# Altium schematic sheet Sheet1.SchDoc
size A4; SheetNumber: 1; SheetTotal: 1
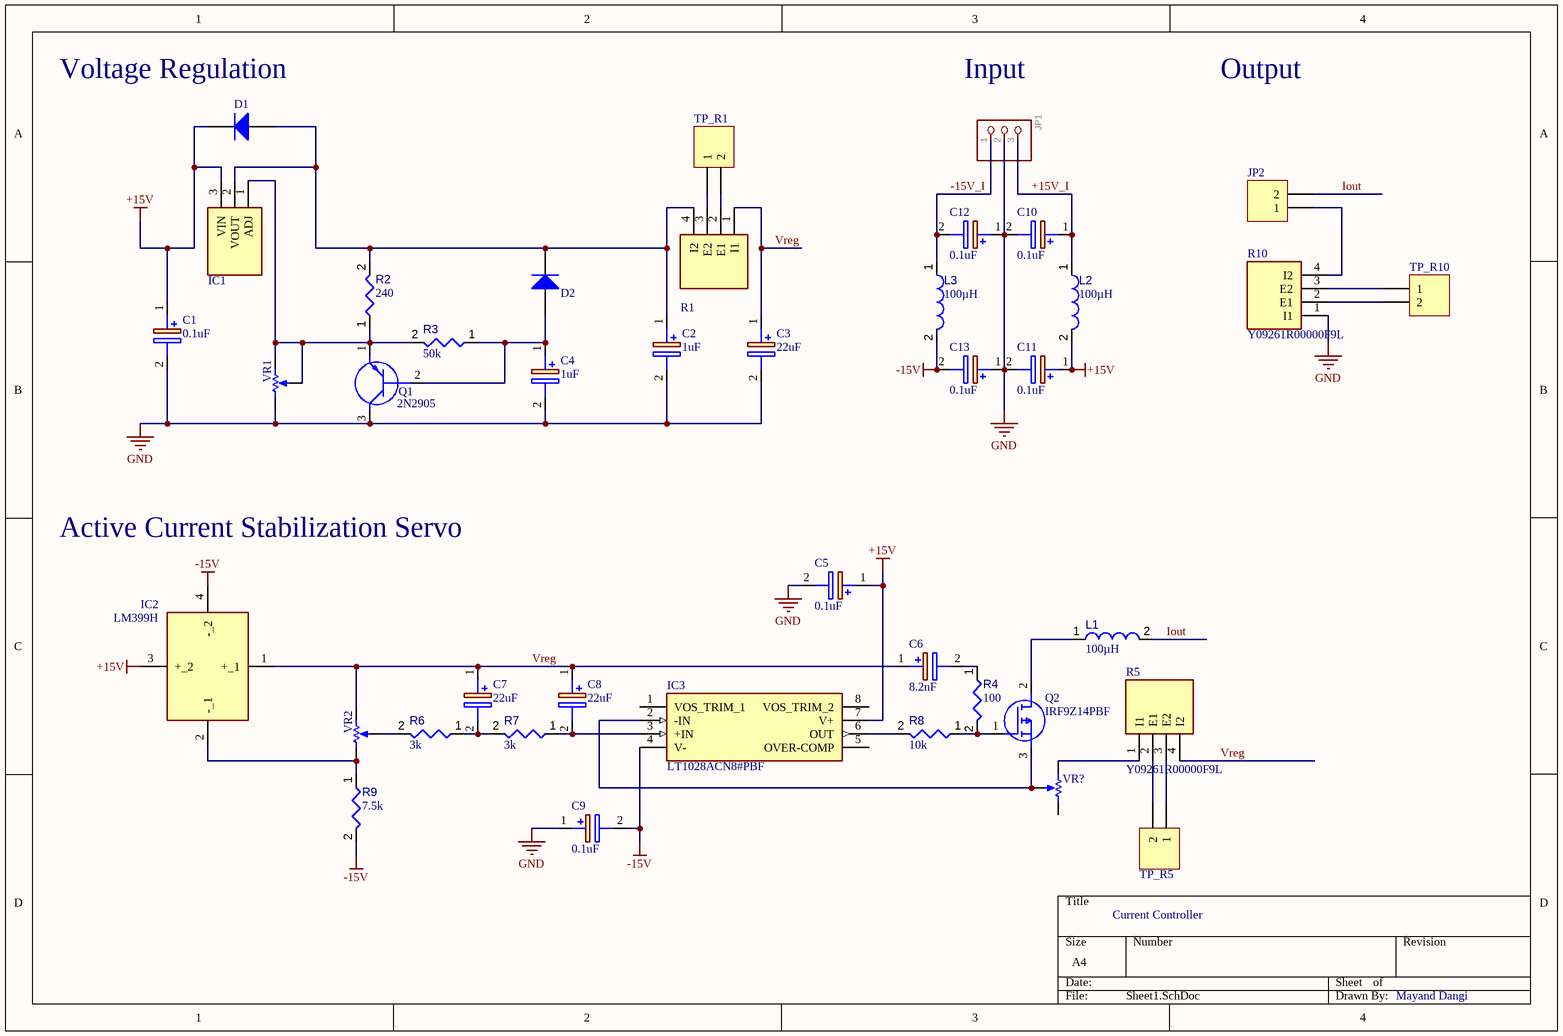
[diagram p0: Sheet1.SchDoc]

## Parts
C1  value 0.1uF  [CAPPRD200W65D525H1250]  (hidden comment: RFS-16V100ME3#5)
C2  value 1uF  [CAPPRD200W65D525H1250]  (hidden comment: RFS-16V100ME3#5)
C3  value 22uF  [CAPPRD200W65D525H1250]  (hidden comment: RFS-16V100ME3#5)
C4  value 1uF  [CAPPRD200W65D525H1250]  (hidden comment: RFS-16V100ME3#5)
C5  value 0.1uF  [CAPPRD200W65D525H1250]  (hidden comment: RFS-16V100ME3#5)
C6  value 8.2nF  [CAPPRD200W65D525H1250]  (hidden comment: RFS-16V100ME3#5)
C7  value 22uF  [CAPPRD200W65D525H1250]  (hidden comment: RFS-16V100ME3#5)
C8  value 22uF  [CAPPRD200W65D525H1250]  (hidden comment: RFS-16V100ME3#5)
C9  value 0.1uF  [CAPPRD200W65D525H1250]  (hidden comment: RFS-16V100ME3#5)
C10  value 0.1uF  [CAPPRD200W65D525H1250]  (hidden comment: RFS-16V100ME3#5)
C11  value 0.1uF  [CAPPRD200W65D525H1250]  (hidden comment: RFS-16V100ME3#5)
C12  value 0.1uF  [CAPPRD200W65D525H1250]  (hidden comment: RFS-16V100ME3#5)
C13  value 0.1uF  [CAPPRD200W65D525H1250]  (hidden comment: RFS-16V100ME3#5)
D1  1N4148  [NXP-SOD27-2_V]  (value not drawn)
D2  1N4148  [NXP-SOD27-2_V]  (value not drawn)
IC1  LM317AT_NOPB  [TO254P470X1028X1955-3P]  (value not drawn)
IC2  LM399H  [LM399H]
IC3  LT1028ACN8#PBF  [DIP794W53P254L1016H394Q8N]
JP1  PIN HEADER  [1X03]  (value not drawn)
JP2  Header 2  [HDR1X2]  (value not drawn)
L1  value 100µH  [INDR62-500-1100X850X1100]  (hidden comment: RL622-101K-RC)
L2  value 100µH  [INDR62-500-1100X850X1100]  (hidden comment: RL622-101K-RC)
L3  value 100µH  [INDR62-500-1100X850X1100]  (hidden comment: RL622-101K-RC)
Q1  2N2905  [2N2905]
Q2  IRF9Z14PBF  [TO254P465X1024X2050-3P]
R1  Y09261R00000F9L  [TO254P401X1016X2196-4P]  (value not drawn)
R2  value 240  [RESA60-630X240]  (hidden comment: MFR-25FBF52-475K)
R3  value 50k  [RESA60-630X240]  (hidden comment: MFR-25FBF52-475K)
R4  value 100  [RESA60-630X240]  (hidden comment: MFR-25FBF52-475K)
R5  Y09261R00000F9L  [TO254P401X1016X2196-4P]
R6  value 3k  [RESA60-630X240]  (hidden comment: MFR-25FBF52-475K)
R7  value 3k  [RESA60-630X240]  (hidden comment: MFR-25FBF52-475K)
R8  value 10k  [RESA60-630X240]  (hidden comment: MFR-25FBF52-475K)
R9  value 7.5k  [RESA60-630X240]  (hidden comment: MFR-25FBF52-475K)
R10  Y09261R00000F9L  [TO254P401X1016X2196-4P]
TP_R1  Header 2  [HDR1X2]  (value not drawn)
TP_R5  Header 2  [HDR1X2]  (value not drawn)
TP_R10  Header 2  [HDR1X2]  (value not drawn)
VR1  3296W-1-103LF  [BOUR-3296W]  (value not drawn)
VR2  3296W-1-103LF  [BOUR-3296W]  (value not drawn)
VR?  3296W-1-103LF  [BOUR-3296W]  (value not drawn)

## Nets
+15V: C1.1(+) C5.1(+) C11.1(+) D1.2(K) IC1.3(VIN) IC2.3(+_2) IC3.7(V+) L2.2
-15V: C9.2(-) C13.2(-) IC2.4(-_2) IC3.4(V-) L3.2 R9.2
GND: C1.2(-) C2.2(-) C3.2(-) C4.2(-) C5.2(-) C9.1(+) C10.2(-) C11.2(-) C12.1(+) C13.1(+) JP1.2 Q1.3(C) R10.1(I1) VR1.1(CCW)
+15V_I: C10.1(+) JP1.3 L2.1
-15V_I: C12.2(-) JP1.1 L3.1
Iout: JP2.2 L1.2
Vreg: C3.1(+) C6.1(+) C7.1(+) C8.1(+) IC2.1(+_1) R1.1(I1) R5.4(I2) VR2.3(CW)
NetC2_1: C2.1(+) D1.1(A) D2.2(K) IC1.2(VOUT) R1.4(I2) R2.2
NetC4_1: C4.1(+) D2.1(A) Q1.2(B) R3.1
NetC6_2: C6.2(-) R4.1
NetC7_2: C7.2(-) R6.1 R7.2
NetC8_2: C8.2(-) IC3.3(+IN) R7.1
NetIC1_1: IC1.1(ADJ) Q1.1(E) R2.1 R3.2 VR1.2(S) VR1.3(CW)
NetIC2_2: IC2.2(-_1) R9.1 VR2.1(CCW)
NetIC3_2: IC3.2(-IN) Q2.3(S) VR?.2(S)
NetIC3_6: IC3.6(OUT) R8.2
NetJP2_1: JP2.1 R10.4(I2)
NetL1_1: L1.1 Q2.2(D)
NetQ2_1: Q2.1(G) R4.2 R8.1
NetR1_2: R1.2(E1) TP_R1.2
NetR1_3: R1.3(E2) TP_R1.1
NetR5_1: R5.1(I1) VR?.1(CCW)
NetR5_2: R5.2(E1) TP_R5.2
NetR5_3: R5.3(E2) TP_R5.1
NetR6_2: R6.2 VR2.2(S)
NetR10_2: R10.2(E1) TP_R10.2
NetR10_3: R10.3(E2) TP_R10.1

Not connected (* = marked no-connect by the designer): IC3 1(VOS_TRIM_1) 5(OVER-COMP) 8(VOS_TRIM_2); VR? 3(CW)

## Notes on the sheet
- (near D1) Voltage Regulation
- (near JP1) Input
- Output
- Active Current Stabilization Servo
- Current Controller
- Mayand Dangi

## Library data of the parts
C1-C13 = RFS-16V100ME3#5: Capacitor Polarised; Manufacturer_Name: Elna; Datasheet Link: http://www.elna.co.jp/en/capacitor/alumi/catalog/pdf/rfs_e.pdf; Height: 12.5mm; Manufacturer_Part_Number: RFS-16V100ME3#5; Mouser Part Number: 555-RFS16V100ME3#5; Mouser Price/Stock: https://www.mouser.co.uk/ProductDetail/Elna/RFS-16V100ME35?qs=HV%2FSjD3ivR%2FtACP0T6MAAg%3D%3D
D1 D2 = CMP-004-00000-2: High Speed Diode, 100 V, 0.45 A, -65 to 175 degC, 2-Pin SOD27, RoHS, Bulk; Manufacturer: Fairchild; Elements: 1; Recovery Time: 4ns; Forward Current: 300mA; Power: 500mW; Forward Voltage: 1V; Max Surge Current: 4A; Peak Reverse Current: 5uA; Datasheet URL: http://www.nxp.com/documents/data_sheet/1N4148_1N4448.pdf; Min Operating Temperature: -65°C; Manufacturer URL: https://www.fairchildsemi.com/; Packaging: Bulk; Diameter: 1.91mm; Pins: 2; Package URL: http://www.nxp.com/documents/data_sheet/1N4148_1N4448.pdf; Package Reference: SOD27; Max Operating Temperature: 175°C; Package Quantity: 2000; Case/Package: DO; Datasheet Version: Aug-04; RoHS Compliant: True
IC1 = LM317AT_NOPB: Integrated Circuit; Manufacturer_Name: Texas Instruments; Manufacturer_Part_Number: LM317AT/NOPB; Datasheet Link: http://www.ti.com/lit/gpn/lm317a; Height: 4.7mm; Mouser Part Number: 926-LM317AT/NOPB; Mouser Price/Stock: https://www.mouser.co.uk/ProductDetail/Texas-Instruments/LM317AT-NOPB?qs=X1J7HmVL2ZFYFJRcNgsWcQ%3D%3D; Arrow Part Number: LM317AT/NOPB; Arrow Price/Stock: https://www.arrow.com/en/products/lm317atnopb/texas-instruments?region=nac
IC2 = LM399H: Integrated Circuit; Manufacturer_Name: Analog Devices; Datasheet Link: https://www.analog.com/media/en/technical-documentation/data-sheets/199399fc.pdf; Height: 2.667mm; Manufacturer_Part_Number: LM399H; Arrow Part Number: LM399H; Arrow Price/Stock: https://www.arrow.com/en/products/lm399h/analog-devices
IC3 = LT1028ACN8#PBF: Integrated Circuit; Manufacturer_Name: Linear Technology; Datasheet Link: http://cds.linear.com/docs/en/datasheet/1028fd.pdf; Height: 3.937mm; Manufacturer_Part_Number: LT1028ACN8#PBF
JP1 = PINHD-1X3: GateName_1: A; SymbolName_1: PINHD3; LibraryName: adafruit; DeviceSetName: PINHD-1X3; Package: 1X03
JP2 TP_R1 TP_R5 TP_R10 = Header 2: Header, 2-Pin; LatestRevisionDate: 17-Jul-2002; LatestRevisionNote: Re-released for DXP Platform.; Publisher: Altium Limited
L1-L3 = CMP-006-00013-6: Radial Inductor, 100 uH, +/- 10%, 0.91 A, -55 to 105 degC, 2-Pin THD, RoHS, Bulk; Manufacturer: Bourns; Q Factor: 20; Shielding: Unshielded; Core Material: Ferrite; Self Resonant Frequency: 3.7MHz; Resistance: 0.28Ohm; Current Rating: 910mA; Datasheet URL: http://www.bourns.com/docs/Product-Datasheets/rl622_series.pdf; Pins: 2; Inductance Tolerance: 10%; Packaging: Bulk; Tolerance: 10%; Diameter: 8.5mm; RoHS Compliant: True; Max Operating Temperature: 105°C; Package Quantity: 100; Package Reference: INDR62-500-1100X850X1100; Mounting Technology: TH; Lead Pitch: 5mm; Datasheet Version: Aug-10; Min Operating Temperature: -55°C; Package Description: 2-Pin Radial Lead, Dia 8.5 mm, Pitch 5 mm; Case/Package: Radial
Q1 = 2N2905: Transistor BJT PNP; Manufacturer_Name: MULTICOMP; Datasheet Link: https://componentsearchengine.com/Datasheets/2/2N2905.pdf; Height: 6.6mm; Manufacturer_Part_Number: 2N2905
Q2 = IRF9Z14PBF: MOSFET (P-Channel); Manufacturer_Name: Vishay; Datasheet Link: https://www.vishay.com/docs/91088/91088.pdf; Height: 4.65mm; Manufacturer_Part_Number: IRF9Z14PBF; Mouser Part Number: 844-IRF9Z14PBF; Mouser Price/Stock: https://www.mouser.co.uk/ProductDetail/Vishay-Semiconductors/IRF9Z14PBF/?qs=cvaI6ThkwxtNPJLFfJQjXw%3D%3D; Arrow Part Number: IRF9Z14PBF; Arrow Price/Stock: https://www.arrow.com/en/products/irf9z14pbf/vishay
R1 R5 R10 = Y09261R00000F9L: Resistor; Manufacturer_Name: Vishay; Datasheet Link: https://www.mouser.com/datasheet/2/428/vpr22021-470867.pdf; Height: 4.01mm; Manufacturer_Part_Number: Y09261R00000F9L; Mouser Part Number: 71-VPR221T1R0000FB; Mouser Price/Stock: https://www.mouser.co.uk/ProductDetail/Vishay-Precision-Group-Foil-Resistors/Y09261R00000F9L?qs=NHnMxE5Fd3z%252BuQNCyVCBVA%3D%3D
R2-R4 R6-R9 = CMP-009-00055-4: Axial Resistor, 475 KOhm, +/- 1%, 0.25 W, -55 to 155 degC, 2-Pin THD, RoHS, Bulk; Manufacturer: Yageo; Power: 250mW; Voltage Rating: 250V; Case/Package: Axial; Mounting Technology: TH; RoHS Compliant: True; Package Description: 2-Pin Axial Lead, Dia 2.4 mm, Body Length 6.3 mm; Min Operating Temperature: -55°C; Datasheet URL: http://www.yageo.com/documents/recent/Yageo%20LR_MFR_2013.pdf; Manufacturer URL: http://www.yageo.com/; Package Quantity: 200; Package Reference: MFR-25; Max Operating Temperature: 155°C; Datasheet Version: Apr-13; Tolerance: 1%; Packaging: Bulk
  R2: .: *
VR1 VR2 VR? = CMP-009-00038-2: Square Trimpot(R) Trimming Potentiometer, 10 KOhm, +/- 10%, 0.5 W, -55 to 125 degC, 3-Pin THD, RoHS, Tube; Manufacturer: Bourns; Voltage Rating: 300V; Power: 500mW; Resistance: 10k; Tolerance: 10%; Min Operating Temperature: -55°C; Case/Package: 3296W; Max Operating Temperature: 150°C; Package Reference: 3296W; Mounting Technology: TH; Manufacturer URL: http://www.bourns.com/; Package Quantity: 50; Package Description: 3-Pin Through Hole Device, Body 9.53 x 4.83 mm, Pitch 2.54 mm; Packaging: Rail/Tube; Datasheet URL: http://www.bourns.com/docs/Product-Datasheets/3296.pdf; RoHS Compliant: True; Datasheet Version: May-16